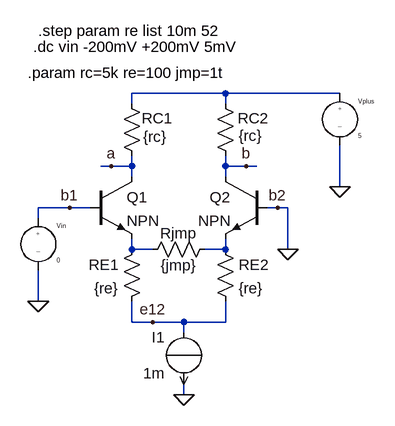
[diagram p0: schematic diff_1-mit-RE.asc]
diff_1-mit-RE.asc, the LTspice schematic file:
Version 4
SHEET 1 880 680
WIRE 352 -32 208 -32
WIRE 528 -32 352 -32
WIRE 208 -16 208 -32
WIRE 352 -16 352 -32
WIRE 176 80 160 80
WIRE 208 80 208 64
WIRE 208 80 176 80
WIRE 352 80 352 64
WIRE 384 80 352 80
WIRE 400 80 384 80
WIRE 208 96 208 80
WIRE 352 96 352 80
WIRE 528 112 528 48
WIRE 112 144 64 144
WIRE 144 144 112 144
WIRE 432 144 416 144
WIRE 448 144 432 144
WIRE 64 160 64 144
WIRE 208 208 208 192
WIRE 240 208 208 208
WIRE 352 208 352 192
WIRE 352 208 320 208
WIRE 448 208 448 144
WIRE 64 288 64 240
WIRE 208 320 208 288
WIRE 240 320 208 320
WIRE 288 320 240 320
WIRE 352 320 352 288
WIRE 352 320 288 320
WIRE 288 336 288 320
WIRE 288 432 288 416
FLAG 528 112 0
FLAG 288 432 0
FLAG 112 144 b1
FLAG 432 144 b2
FLAG 240 320 e12
FLAG 448 208 0
FLAG 384 80 b
FLAG 176 80 a
FLAG 64 288 0
SYMBOL source-I 288 416 R180
WINDOW 0 29 73 Left 2
WINDOW 3 29 17 Left 2
SYMATTR InstName I1
SYMATTR Value 1m
SYMBOL EIT_Semiconductors\\npn 144 96 R0
SYMATTR InstName Q1
SYMBOL EIT_Semiconductors\\npn 416 96 M0
SYMATTR InstName Q2
SYMBOL source-V 64 144 R0
SYMATTR InstName Vin
SYMATTR Value 0
SYMBOL source-V 528 -48 R0
SYMATTR InstName Vplus
SYMATTR Value 5
SYMBOL res 192 -32 R0
WINDOW 0 31 38 Left 2
WINDOW 3 33 67 Left 2
SYMATTR InstName RC1
SYMATTR Value {rc}
SYMBOL res 336 -32 R0
WINDOW 0 35 38 Left 2
WINDOW 3 36 65 Left 2
SYMATTR InstName RC2
SYMATTR Value {rc}
SYMBOL res 224 192 M0
SYMATTR InstName RE1
SYMATTR Value {re}
SYMBOL res 336 192 R0
SYMATTR InstName RE2
SYMATTR Value {re}
SYMBOL res 336 192 R90
WINDOW 0 7 56 VBottom 2
WINDOW 3 25 56 VTop 2
SYMATTR InstName Rjmp
SYMATTR Value {jmp}
TEXT 56 -104 Left 2 !.dc vin -200mV +200mV 5mV
TEXT 48 -64 Left 2 !.param rc=5k re=100 jmp=1t
TEXT 64 -128 Left 2 !.step param re list 10m 52

The netlist it stands for:
* diff_1-mit-RE.asc
I1 e12 0 1m
Q1 a b1 N002 0 NPN
Q2 b 0 N003 0 NPN
Vin b1 0 0
Vplus N001 0 5
RC1 N001 a {rc}
RC2 N001 b {rc}
RE1 N002 e12 {re}
RE2 N003 e12 {re}
Rjmp N003 N002 {jmp}
.model NPN NPN
.model PNP PNP
.lib standard.bjt
.dc vin -200mV +200mV 5mV
.param rc=5k re=100 jmp=1t
.step param re list 10m 52
.backanno
.end